# EAGLE design rc2014-dazzler (EAGLE 9.5.2)
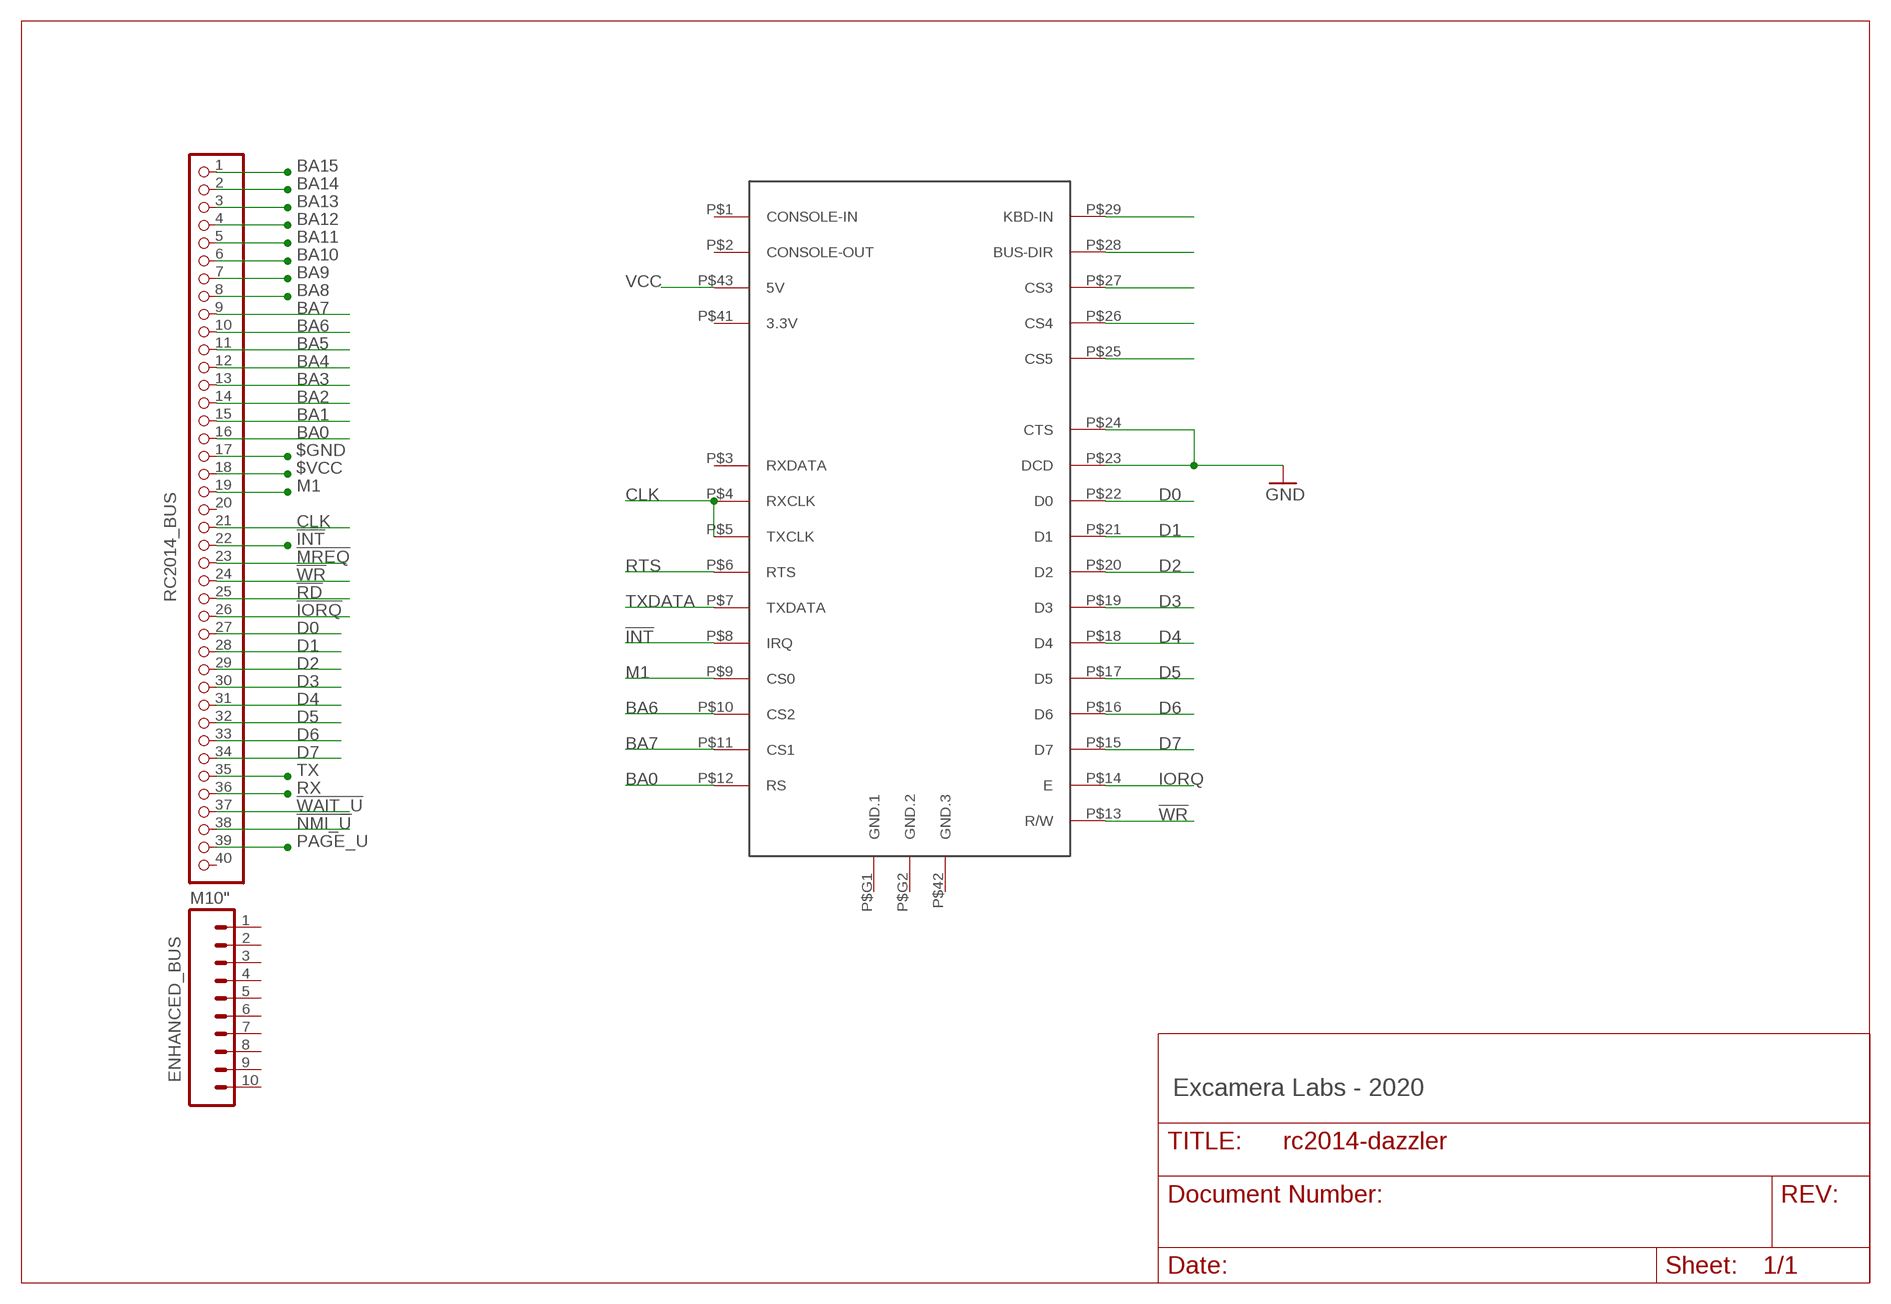
[diagram p0: schematic, sheet 1]

## Parts
ENHANCED_BUS  M10"  [1X10]
RC2014_BUS  RC2014 BUS  PINHD-1X40  [1X40]
U$1  DAZZLER-6850-SOCKET  [DAZZLER-SOCKET]

## Nets
!INT: RC2014_BUS.22 U$1.P$8(IRQ)
!IORQ: RC2014_BUS.26
!MREQ: RC2014_BUS.23
!NMI_U: RC2014_BUS.38
!RD: RC2014_BUS.25
!WAIT_U: RC2014_BUS.37
!WR: RC2014_BUS.24 U$1.P$13(R/W)
$GND: RC2014_BUS.17
$VCC: RC2014_BUS.18
BA0: RC2014_BUS.16 U$1.P$12(RS)
BA1: RC2014_BUS.15
BA2: RC2014_BUS.14
BA3: RC2014_BUS.13
BA4: RC2014_BUS.12
BA5: RC2014_BUS.11
BA6: RC2014_BUS.10 U$1.P$10(CS2)
BA7: RC2014_BUS.9 U$1.P$11(CS1)
BA8: RC2014_BUS.8
BA9: RC2014_BUS.7
BA10: RC2014_BUS.6
BA11: RC2014_BUS.5
BA12: RC2014_BUS.4
BA13: RC2014_BUS.3
BA14: RC2014_BUS.2
BA15: RC2014_BUS.1
CLK: RC2014_BUS.21 U$1.P$4(RXCLK) U$1.P$5(TXCLK)
D0: RC2014_BUS.27 U$1.P$22(D0)
D1: RC2014_BUS.28 U$1.P$21(D1)
D2: RC2014_BUS.29 U$1.P$20(D2)
D3: RC2014_BUS.30 U$1.P$19(D3)
D4: RC2014_BUS.31 U$1.P$18(D4)
D5: RC2014_BUS.32 U$1.P$17(D5)
D6: RC2014_BUS.33 U$1.P$16(D6)
D7: RC2014_BUS.34 U$1.P$15(D7)
GND: U$1.P$23(DCD) U$1.P$24(CTS)
IORQ: U$1.P$14(E)
M1: RC2014_BUS.19 U$1.P$9(CS0)
N$13: U$1.P$25(CS5)
N$14: U$1.P$26(CS4)
N$15: U$1.P$27(CS3)
N$16: U$1.P$28(BUS-DIR)
N$17: U$1.P$29(KBD-IN)
PAGE_U: RC2014_BUS.39
RTS: U$1.P$6(RTS)
RX: RC2014_BUS.36
TX: RC2014_BUS.35
TXDATA: U$1.P$7(TXDATA)
VCC: U$1.P$43(5V)
Unconnected: ENHANCED_BUS.1 ENHANCED_BUS.2 ENHANCED_BUS.3 ENHANCED_BUS.4 ENHANCED_BUS.5 ENHANCED_BUS.6 ENHANCED_BUS.7 ENHANCED_BUS.8 ENHANCED_BUS.9 ENHANCED_BUS.10 RC2014_BUS.20 RC2014_BUS.40 U$1.P$1(CONSOLE-IN) U$1.P$2(CONSOLE-OUT) U$1.P$3(RXDATA) U$1.P$41(3.3V) U$1.P$42(GND.3) U$1.P$G1(GND.1) U$1.P$G2(GND.2)

## Notes on the sheet
- Excamera Labs - 2020

## Library data of the parts
ENHANCED_BUS = SparkFun:M10: Header 10 Standard 10-pin 0.1" header. Use with straight break away headers (SKU : PRT-00116), right angle break away headers (PRT-00553), swiss pins (PRT-00743), machine pins (PRT-00117), and female headers (PRT-00115).
RC2014_BUS = pinhead:PINHD-1X40: PIN HEADER
U$1 = gd3x-dazzler:DAZZLER-6850-SOCKET

## Board
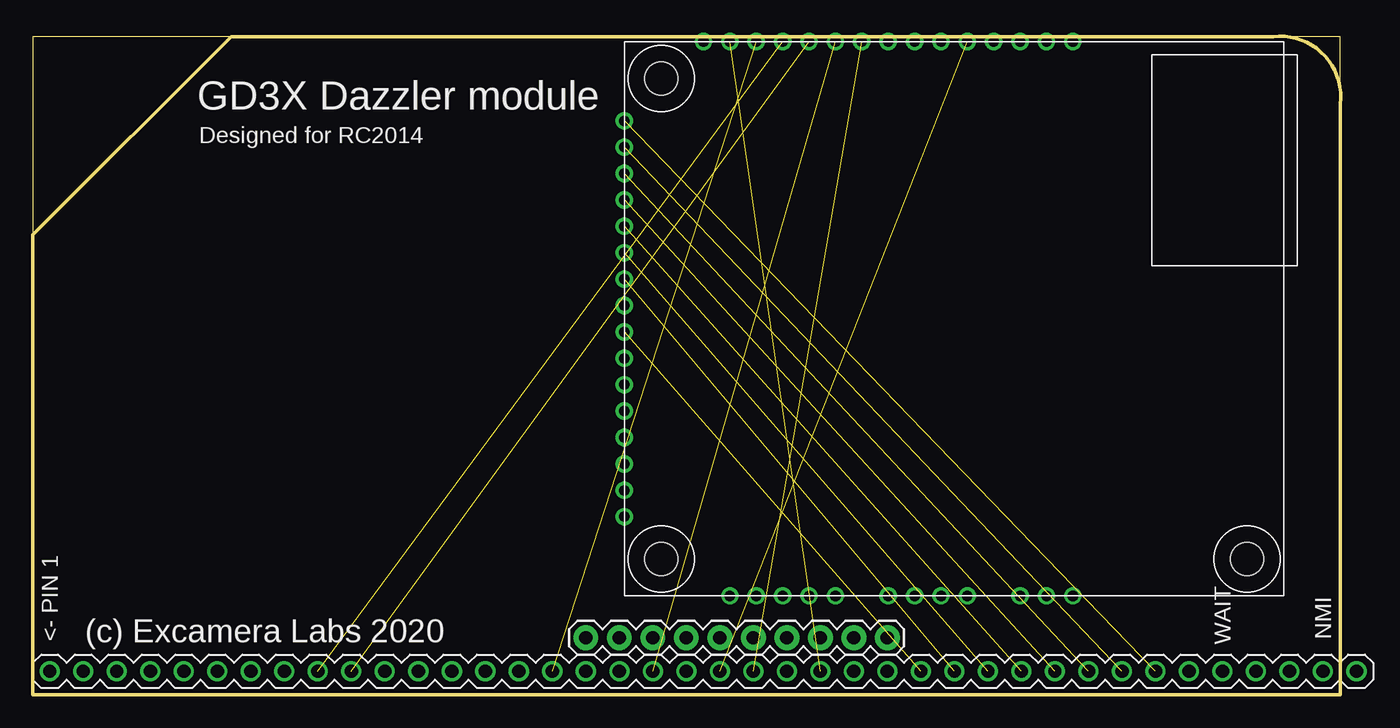
[diagram p1: board, top side]
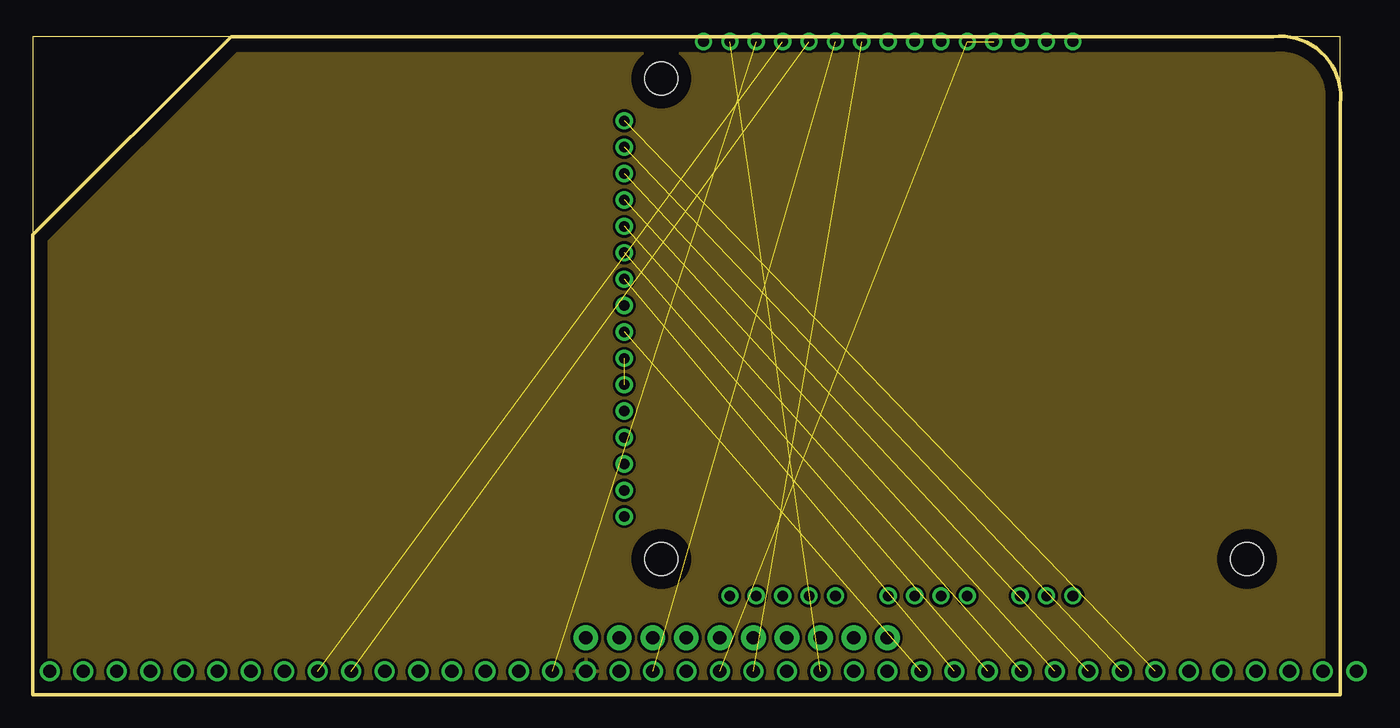
[diagram p2: board, inner layer GND]
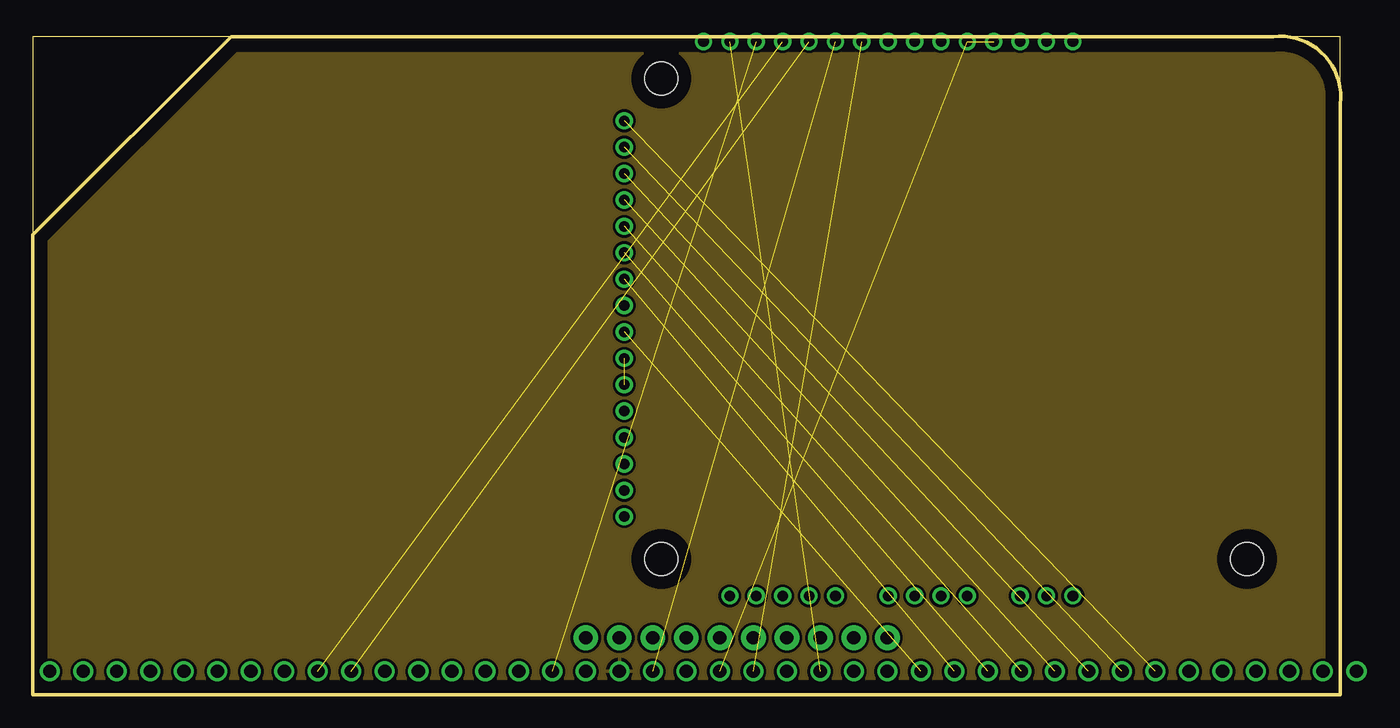
[diagram p3: board, inner layer VCC]
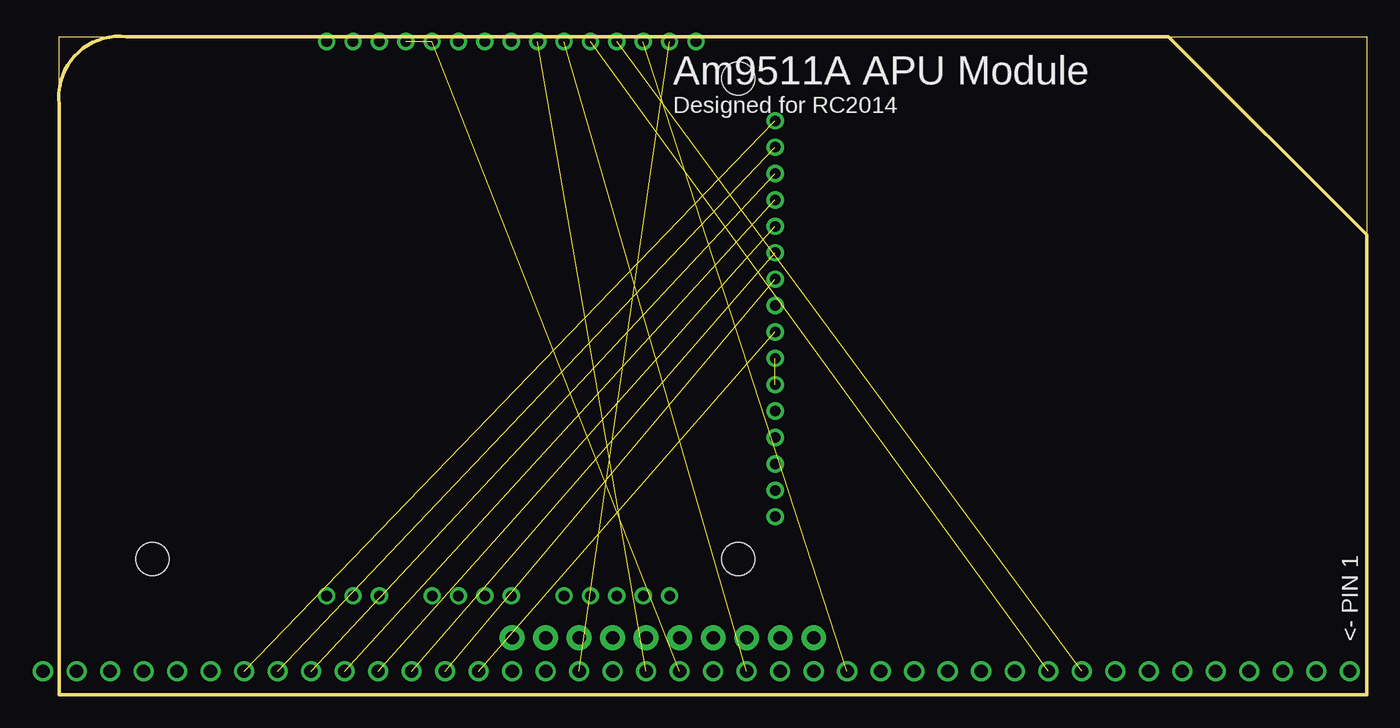
[diagram p4: board, bottom side, seen from below]

Size 99.14 x 49.89 mm. Coordinates in mm from the lower left corner, seen from the top.
Outline: 99.11,44.76 99.11,49.86 94.01,49.86
Outline: 15.01,49.86 0,49.86 0,34.85
Outline: 0,34.85 15.01,49.86
Outline: 94.01,49.86 arc-104 99.11,44.76
Outline: 15.01,49.86 94.01,49.86
Outline: 99.11,44.76 99.11,0 0,0 0,34.85
Copper layers (1*2*15*16): Top 0.035mm / dielectric 0.3mm / GND 0.035mm / dielectric 0.3mm / VCC 0.035mm / dielectric 0.3mm / Bottom 0.035mm
Design rules "default *": minimum track width 10mil, minimum drill 24mil, track to track 8mil, track to pad 8mil, pad to pad 8mil, via to via 8mil, smd to smd 8mil, copper to edge 40mil, drill to drill 8mil, minimum pad ring 10mil, minimum via ring 8mil, stop-mask expansion 4mil, vias tented up to drill 0mil, thermal gap 10mil

### Footprints (pad centres in the part's own frame; a part is rotated, then mirrored left to right if it is on the bottom)
1X10 = drill 1.016 pad 1.88: 1 0,0; 2 2.54,0; 3 5.08,0; 4 7.62,0; 5 10.16,0; 6 12.7,0; 7 15.24,0; 8 17.78,0; 9 20.32,0; 10 22.86,0
1X40 = drill 1.016: 1 -49.53,0; 2 -46.99,0; 3 -44.45,0; 4 -41.91,0; 5 -39.37,0; 6 -36.83,0; 7 -34.29,0; 8 -31.75,0; 9 -29.21,0; 10 -26.67,0; 11 -24.13,0; 12 -21.59,0; 13 -19.05,0; 14 -16.51,0; 15 -13.97,0; 16 -11.43,0; 17 -8.89,0; 18 -6.35,0; 19 -3.81,0; 20 -1.27,0; 21 1.27,0; 22 3.81,0; 23 6.35,0; 24 8.89,0; 25 11.43,0; 26 13.97,0; 27 16.51,0; 28 19.05,0; 29 21.59,0; 30 24.13,0; 31 26.67,0; 32 29.21,0; 33 31.75,0; 34 34.29,0; 35 36.83,0; 36 39.37,0; 37 41.91,0; 38 44.45,0; 39 46.99,0; 40 49.53,0
DAZZLER-SOCKET = drill 0.8: P$1 9.87,21.68; P$2 7.87,21.68; P$3 5.87,21.68; P$4 3.87,21.68; P$5 1.87,21.68; P$6 -0.13,21.68; P$7 -2.13,21.68; P$8 -6.13,21.68; P$9 -8.13,21.68; P$10 -10.13,21.68; P$11 -12.13,21.68; P$12 -14.13,21.68; P$13 -16.13,21.68; P$14 -18.13,21.68; P$15 -24.13,15.68; P$16 -24.13,13.68; P$17 -24.13,11.68; P$18 -24.13,9.68; P$19 -24.13,7.68; P$20 -24.13,5.68; P$21 -24.13,3.68; P$22 -24.13,-0.32; P$23 -24.13,-2.32; P$24 -24.13,-4.32; P$25 -24.13,-6.32; P$26 -24.13,-8.32; P$27 -24.13,-10.32; P$28 -24.13,-12.32; P$29 -24.13,-14.32; P$32 -16.13,-20.32; P$33 -14.13,-20.32; P$34 -12.13,-20.32; P$35 -10.13,-20.32; P$36 -8.13,-20.32; P$37 -4.13,-20.32; P$38 -2.13,-20.32; P$39 -0.13,-20.32; P$40 1.87,-20.32; P$41 5.87,-20.32; P$42 7.87,-20.32; P$43 9.87,-20.32; P$G1 -4.13,21.68; P$G2 -24.13,1.68 | hole 2.5: -21.33,18.88; -21.33,-17.52; 23.07,-17.52

### Placement (x,y rotation side)
ENHANCED_BUS  41.91,4.32 0 top
RC2014_BUS  50.8,1.78 0 top
U$1  68.96,27.81 0 top

### Tracks (layer width: path | path; a pad name or v marks a point on that pad's centre or on a via)
!INT  (1 unrouted)
!WR  (1 unrouted)
$GND
  pour GND: 14.61,49.53 95.25,49.53 arc-90 99.06,45.72 99.06,0 0,0 0,34.92
$VCC
  pour VCC: 14.99,49.91 94.61,49.91 arc-90 99.06,45.72 99.06,0 0,0 0,34.92
BA0  (1 unrouted)
BA6  (1 unrouted)
BA7  (1 unrouted)
CLK  (2 unrouted)
D0  (1 unrouted)
D1  (1 unrouted)
D2  (1 unrouted)
D3  (1 unrouted)
D4  (1 unrouted)
D5  (1 unrouted)
D6  (1 unrouted)
D7  (1 unrouted)
GND  (1 unrouted)
M1  (1 unrouted)

### Text on the board
tPlace: GD3X Dazzler module | Designed for RC2014 | <- PIN 1 | (c) Excamera Labs 2020 | WAIT | NMI
bPlace: Am9511A APU Module | Designed for RC2014 | <- PIN 1